# Altium schematic sheet OPM.SchDoc: Optical Power Meter
size A4; Date: 03-09-2026; Author: Peilin Perry Xu; CompanyName: N/A; DrawnBy: Peilin Perry Xu; Engineer: Peilin Perry Xu; Organization: N/A; Address1: 89 Chestnut Street, Toronto, ON, Canada; Address2: 79 Brass Drive, Richmond Hill, ON, Canada; DocumentNumber: 1; Revision: 1; SheetNumber: 1; SheetTotal: 11
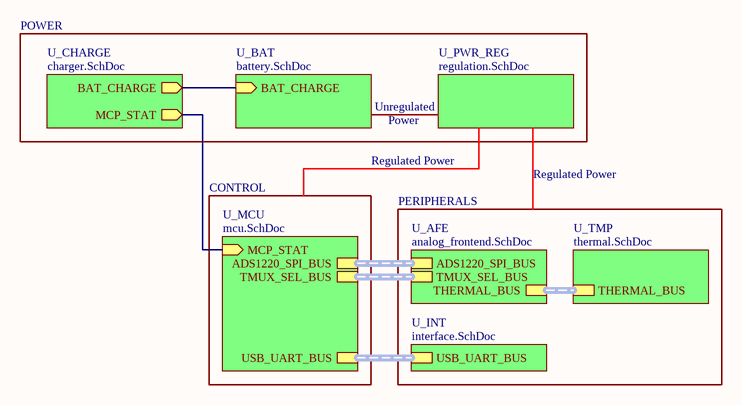
[diagram p0: OPM.SchDoc]

## Sub-sheets
U_AFE = analog_frontend.SchDoc: ADS1220_SPI_BUS (harness ADS1220_SPI_BUS), TMUX_SEL_BUS (harness TMUX_SEL_BUS), THERMAL_BUS (harness THERMAL_BUS)
U_BAT = battery.SchDoc: BAT_CHARGE (in)
U_CHARGE = charger.SchDoc: BAT_CHARGE (out), MCP_STAT (out)
U_INT = interface.SchDoc: USB_UART_BUS (harness USB_UART_BUS)
U_MCU = mcu.SchDoc: USB_UART_BUS (harness USB_UART_BUS), ADS1220_SPI_BUS (harness ADS1220_SPI_BUS), TMUX_SEL_BUS (harness TMUX_SEL_BUS), MCP_STAT (in)
U_PWR_REG = regulation.SchDoc: no entries
U_TMP = thermal.SchDoc: THERMAL_BUS (harness THERMAL_BUS)

## Nets
(unnamed): sheet U_MCU/MCP_STAT, sheet U_CHARGE/MCP_STAT
(unnamed): sheet U_BAT/BAT_CHARGE, sheet U_CHARGE/BAT_CHARGE

## Buses and harness runs
harness sheet U_AFE/ADS1220_SPI_BUS = sheet U_MCU/ADS1220_SPI_BUS
harness sheet U_AFE/THERMAL_BUS = sheet U_TMP/THERMAL_BUS
harness sheet U_AFE/TMUX_SEL_BUS = sheet U_MCU/TMUX_SEL_BUS
harness sheet U_INT/USB_UART_BUS = sheet U_MCU/USB_UART_BUS

## Notes on the sheet
- POWER
- Unregulated
- Power
- CONTROL
- Regulated Power
- PERIPHERALS